# EAGLE design M5 Atom (EAGLE 6.6.0)
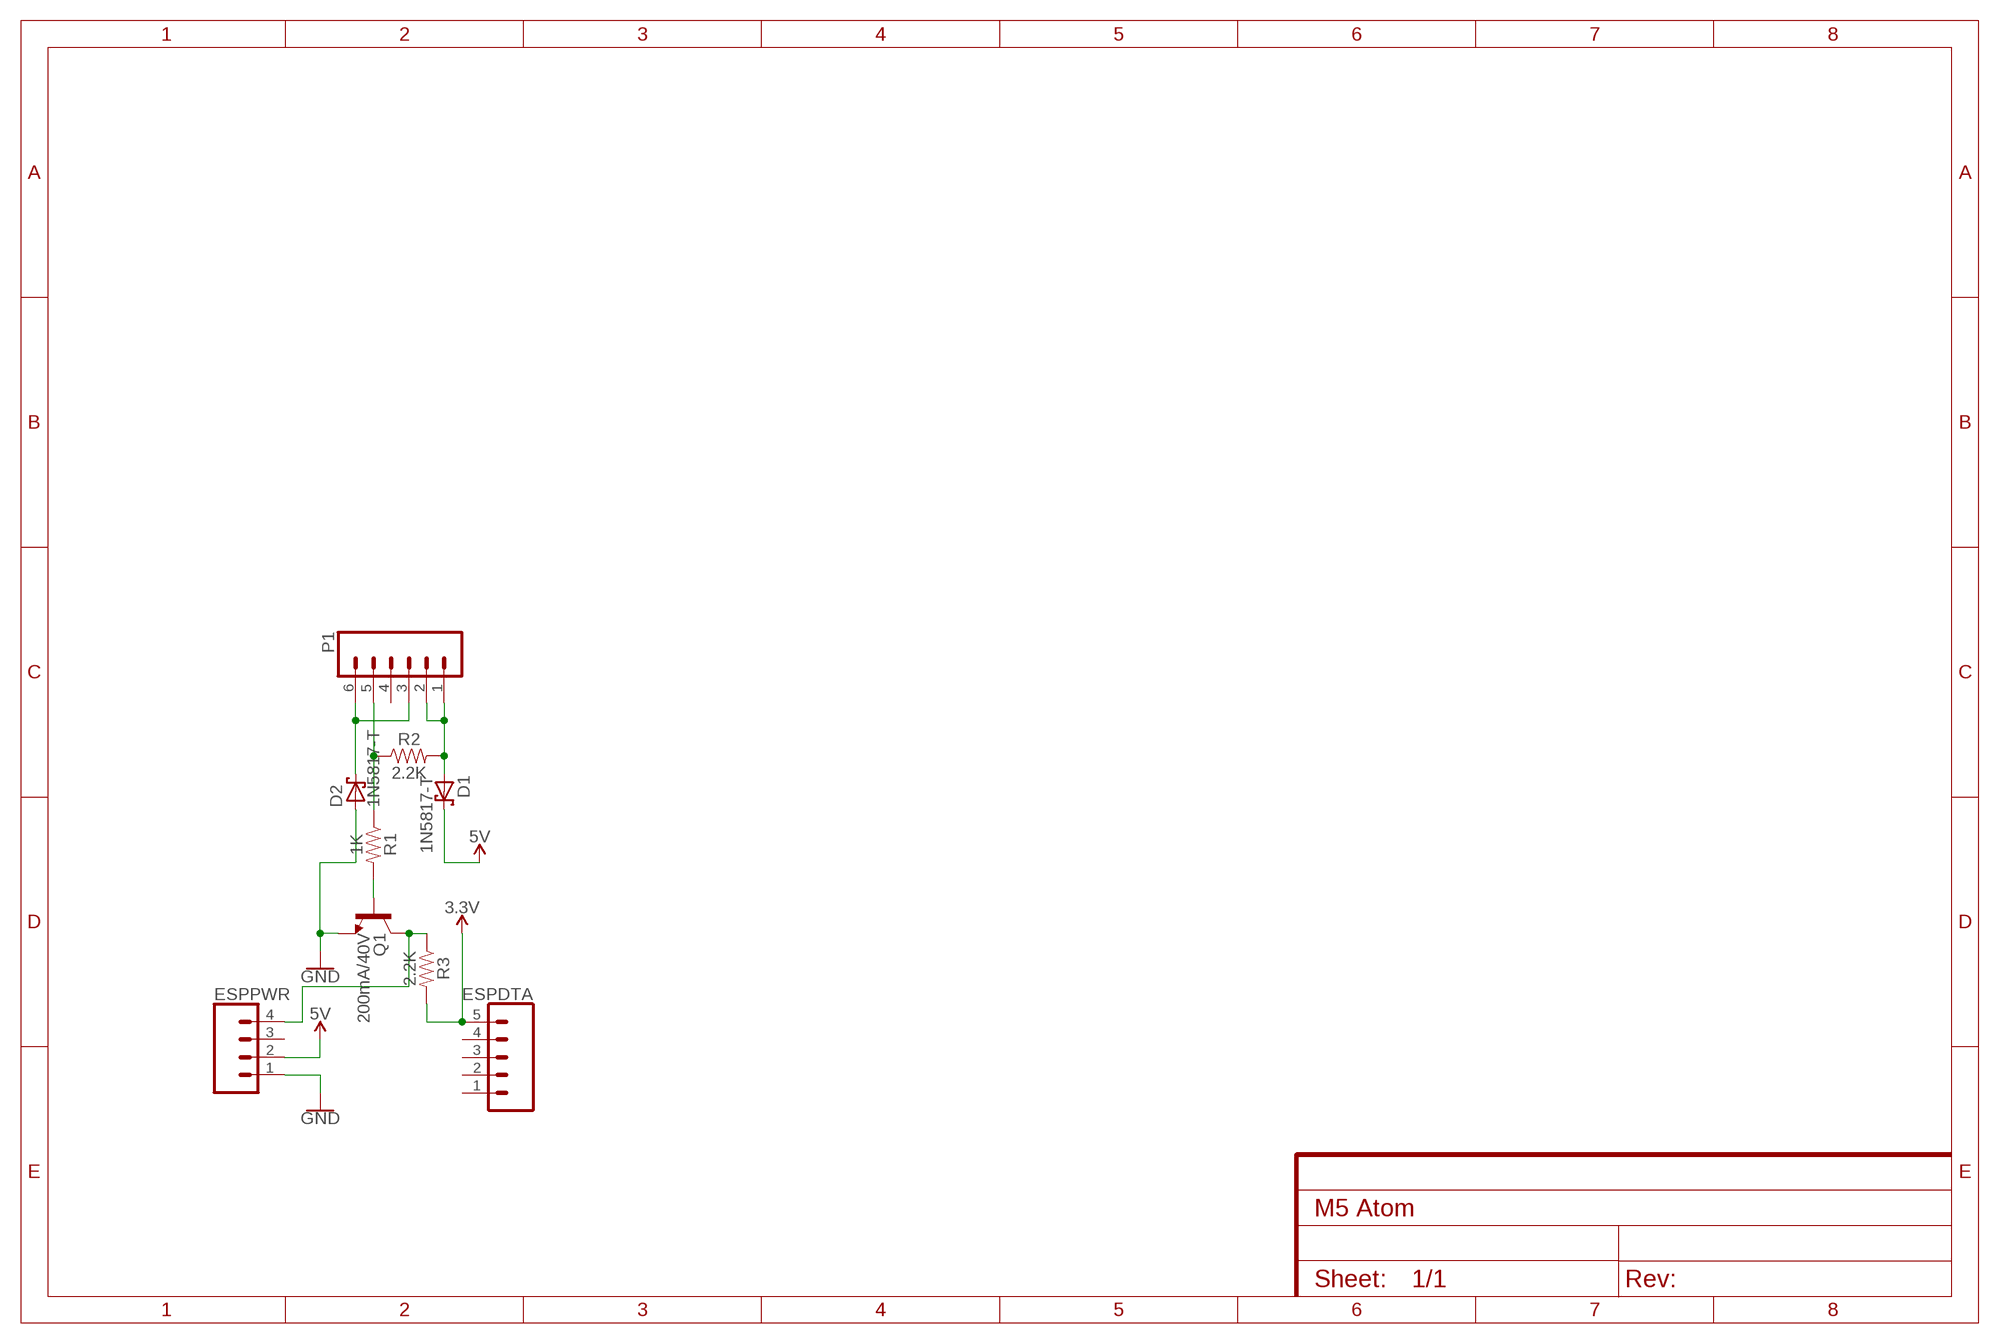
[diagram p0: schematic, sheet 1]

## Parts
D1  1N5817-T  [DO41-7.6]
D2  1N5817-T  [DO41-7.6]
ESPDTA  CONN_05  [1X05]
ESPPWR  CONN_04PTH  [1X04]
P1  CONN_06SILK_FEMALE_PTH  [1X06]
Q1  200mA/40V  TRANS_NPN-2N3904  [TO-92]
R1  1K  RESISTORAXIAL-0.3  [AXIAL-0.3]
R2  2.2K  RESISTORAXIAL-0.3  [AXIAL-0.3]
R3  2.2K  RESISTORAXIAL-0.3  [AXIAL-0.3]

## Nets
3.3V: ESPDTA.5 R3.P$2
5V: D1.C ESPPWR.2
5VH: D1.A P1.1 P1.2 R2.P$2
GND: D2.A ESPPWR.1 Q1.1(E)
GNDH: D2.C P1.3 P1.6
N$2: Q1.2(B) R1.P$2
TXH: P1.5 R1.P$1 R2.P$1
TXL: ESPPWR.4 Q1.3(C) R3.P$1
Unconnected: ESPDTA.1 ESPDTA.2 ESPDTA.3 ESPDTA.4 ESPPWR.3 P1.4

## Library data of the parts
D1 D2 = diode:1N581*: 1.0A SCHOTTKY BARRIER RECTIFIER Source: http://www.diodes.com/datasheets/ds23001.pdf
ESPDTA = SparkFun-Connectors:CONN_05: Multi connection point. Often used as Generic Header-pin footprint for 0.1 inch spaced/style header connections On any of the 0.1 inch spaced packages, you can populate with these: Break Away Headers - Straight <https://www.sparkfun.com/products/116> (PRT-00116) Break Away Male Headers - Right Angle <https://www.sparkfun.com/products/553> (PRT-00553) Female Headers <https://www.sparkfun.com/products/115> (PRT-00115) Break Away Headers - Machine Pin <https://www.sparkfun.com/products/117> (PRT-00117) Break Away Female Headers - Swiss Machine Pin <https://www.sparkfun.com/products/743> (PRT-00743) For SCREWTERMINALS and SPRING TERMINALS visit here: Screw Terimnals on SparkFun.com <https://www.sparkfun.com/search/results?term=Screw+Terminals> (5mm/3.5mm/2.54mm spacing) This device is also useful as a general connection point to wire up your design to another part of your project. Our various solder wires solder well into these plated through hole pads. Hook-Up Wire - Assortment (Stranded, 22 AWG) <https://www.sparkfun.com/products/11375> (PRT-11375) Hook-Up Wire - Assortment (Solid Core, 22 AWG) <https://www.sparkfun.com/products/11367> (PRT-11367) View the entire wire category on our website here <https://www.sparkfun.com/categories/141> Special notes: Molex polarized connector foot print use with SKU : PRT-08231 with associated crimp pins and housings. 1MM SMD Version SKU: PRT-10208
ESPPWR = SparkFun-Connectors:CONN_04: Multi connection point. Often used as Generic Header-pin footprint for 0.1 inch spaced/style header connections On any of the 0.1 inch spaced packages, you can populate with these: Break Away Headers - Straight <https://www.sparkfun.com/products/116> (PRT-00116) Break Away Male Headers - Right Angle <https://www.sparkfun.com/products/553> (PRT-00553) Female Headers <https://www.sparkfun.com/products/115> (PRT-00115) Break Away Headers - Machine Pin <https://www.sparkfun.com/products/117> (PRT-00117) Break Away Female Headers - Swiss Machine Pin <https://www.sparkfun.com/products/743> (PRT-00743) For SCREWTERMINALS and SPRING TERMINALS visit here: Screw Terimnals on SparkFun.com <https://www.sparkfun.com/search/results?term=Screw+Terminals> (5mm/3.5mm/2.54mm spacing) This device is also useful as a general connection point to wire up your design to another part of your project. Our various solder wires solder well into these plated through hole pads. Hook-Up Wire - Assortment (Stranded, 22 AWG) <https://www.sparkfun.com/products/11375> (PRT-11375) Hook-Up Wire - Assortment (Solid Core, 22 AWG) <https://www.sparkfun.com/products/11367> (PRT-11367) View the entire wire category on our website here <https://www.sparkfun.com/categories/141> Special notes: Molex polarized connector foot print use with SKU : PRT-08231 with associated crimp pins and housings. 1MM SMD Version SKU: PRT-10208; PROD_ID: CONN-09696
P1 = SparkFun-Connectors:CONN_06: Multi connection point. Often used as Generic Header-pin footprint for 0.1 inch spaced/style header connections On any of the 0.1 inch spaced packages, you can populate with these: Break Away Headers - Straight <https://www.sparkfun.com/products/116> (PRT-00116) Break Away Male Headers - Right Angle <https://www.sparkfun.com/products/553> (PRT-00553) Female Headers <https://www.sparkfun.com/products/115> (PRT-00115) Break Away Headers - Machine Pin <https://www.sparkfun.com/products/117> (PRT-00117) Break Away Female Headers - Swiss Machine Pin <https://www.sparkfun.com/products/743> (PRT-00743) Arduino Stackable Header - 6 Pin <https://www.sparkfun.com/products/9280> (PRT-09280) For SCREWTERMINALS and SPRING TERMINALS visit here: Screw Terimnals on SparkFun.com <https://www.sparkfun.com/search/results?term=Screw+Terminals> (5mm/3.5mm/2.54mm spacing) This device is also useful as a general connection point to wire up your design to another part of your project. Our various solder wires solder well into these plated through hole pads. Hook-Up Wire - Assortment (Stranded, 22 AWG) <https://www.sparkfun.com/products/11375> (PRT-11375) Hook-Up Wire - Assortment (Solid Core, 22 AWG) <https://www.sparkfun.com/products/11367> (PRT-11367) View the entire wire category on our website here <https://www.sparkfun.com/categories/141>; PROD_ID: CONN-08437
Q1 = SparkFun-DiscreteSemi:TRANS_NPN: NPN transistor Current controlled devices typically used to amplify current or used as a switch. BC547 - COM-08928 <http://www.sparkfun.com/products/8928> (TO-92 45V 100mA) (1.Collector 2.Base 3.Emitter) 2N3904 - COM-00521 <http://www.sparkfun.com/products/521> (TO-92 40V 200mA) (1.Emitter 2.Base 3.Collector) P2N2222A - COM-12852 <http://www.sparkfun.com/products/12852> (TO-92 40V 600mA) (1.Collector 2.Base 3.Emitter); PROD_ID: TRANS-08447
R1-R3 = SparkFun-Resistors:RESISTOR: Generic Resistor Package

## Board
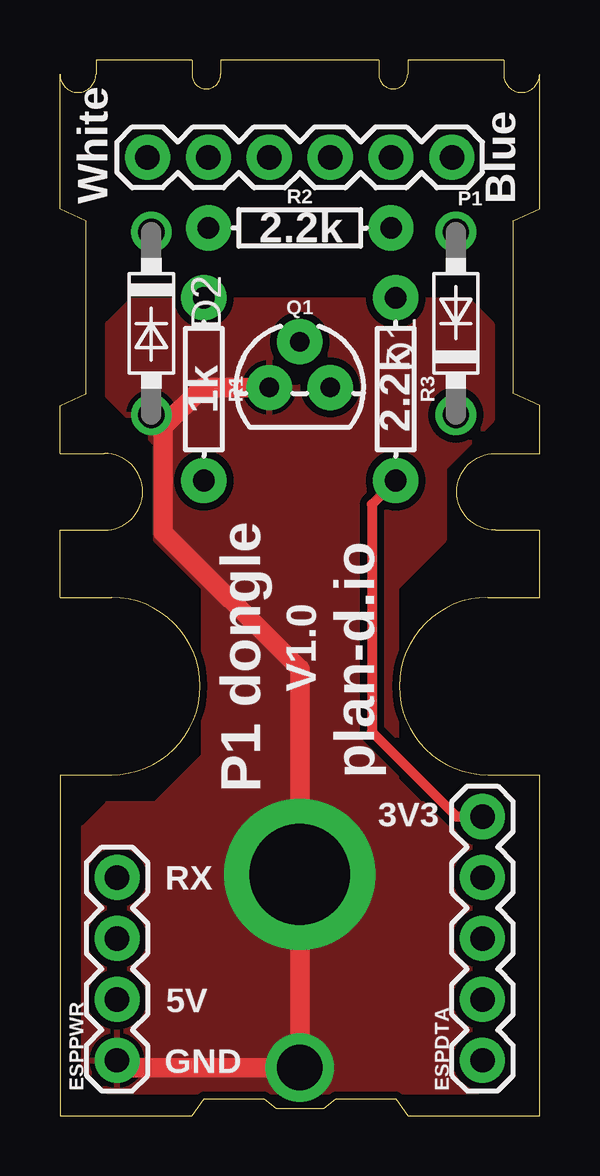
[diagram p1: board, top side]
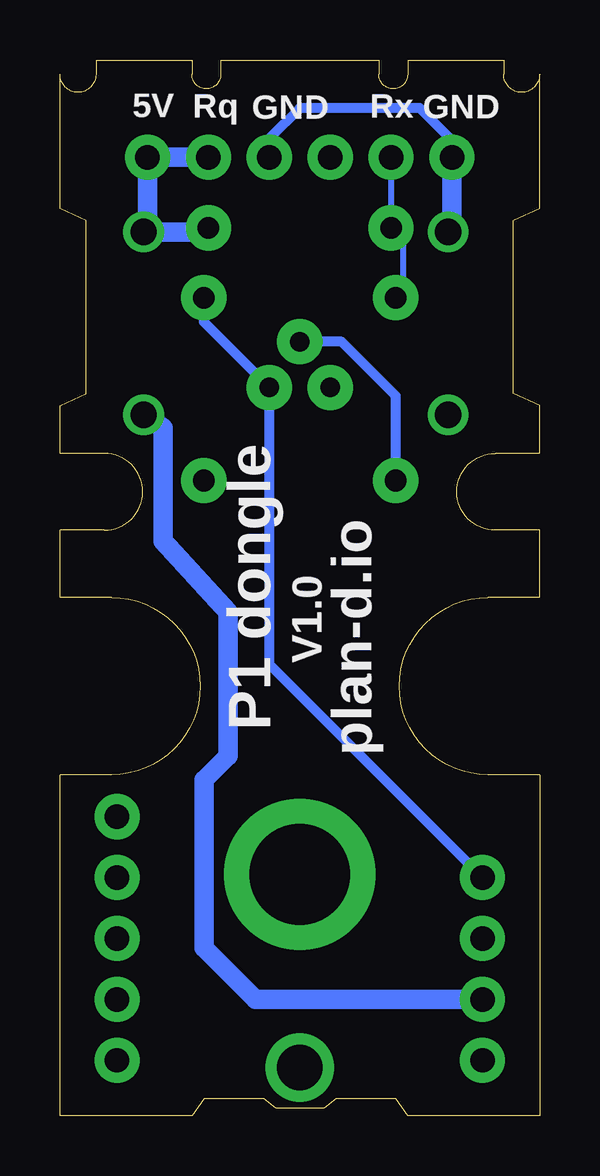
[diagram p2: board, bottom side, seen from below]

Size 20 x 44 mm. Coordinates in mm from the lower left corner, seen from the top.
Outline: 0,0 5.5,0 6,0.7 8.5,0.7 9,0.3 11,0.3 11.5,0.7 14,0.7 14.5,0 20,0 20,14.2 17.85,14.2 arc-180 17.85,21.6 20,21.6 20,24.4 18.15,24.4 arc-180 18.15,27.6 20,27.6 20,29.6 18.9,30.1 18.9,37.3 20,37.8 20,43.4 arc-180 18.5,43.4 18.5,44 14.5,44 14.5,43.4 arc-180 13.3,43.4 13.3,44 6.7,44 6.7,43.4 arc-180 5.5,43.4 5.5,44 1.5,44 1.5,43.4 arc-180 0,43.4 0,37.8 1.1,37.3 1.1,30.1 0,29.6 0,27.6 1.85,27.6 arc-180 1.85,24.4 0,24.4 0,21.6 2.15,21.6 arc-180 2.15,14.2 0,14.2 0,0
Copper layers (1*16): Top 0.018mm / dielectric 1.55mm / Bottom 0.018mm
Design rules "eC_2Layer_PClass6_BaseCopperO18_eCDefault": minimum track width 0.15mm, minimum drill 0.35mm, track to track 0.15mm, track to pad 0.15mm, pad to pad 0.15mm, via to via 0.15mm, smd to smd 0mil, copper to edge 0.25mm, drill to drill 0.35mm, minimum pad ring 0.175mm, minimum via ring 0.125mm, stop-mask expansion 0mil, vias tented up to drill 0.45mm, thermal gap 0.2mm

### Footprints (pad centres in the part's own frame; a part is rotated, then mirrored left to right if it is on the bottom)
DO41-7.6 = drill 1.1 pad 1.7: A 3.81,0; C -3.81,0
1X05 = drill 1.016 pad 1.88: 1 0,0; 2 2.54,0; 3 5.08,0; 4 7.62,0; 5 10.16,0
1X04 = drill 1.016 pad 1.88: 1 0,0; 2 2.54,0; 3 5.08,0; 4 7.62,0
1X06 = drill 1.016 pad 1.88: 1 0,0; 2 2.54,0; 3 5.08,0; 4 7.62,0; 5 10.16,0; 6 12.7,0
TO-92 = drill 0.813 pad 1.88: 1 -1.27,0; 2 0,1.905; 3 1.27,0
AXIAL-0.3 = drill 0.9 pad 1.88: P$1 -3.81,0; P$2 3.81,0

### Placement (x,y rotation side)
D1  16.51,33.02 90 top
D2  3.81,33.02 270 top
ESPDTA  17.62,2.3 90 top
ESPPWR  2.38,2.3 90 top
P1  16.35,39.94 180 top
Q1  10,30.35 0 top
R1  6,30.28 270 top
R2  10,37 0 top
R3  14,30.28 270 top

### Tracks (layer width: path | path; a pad name or v marks a point on that pad's centre or on a via)
3.3V
  Top 0.406: R3.P$2 13,25.47 13,16 16.54,12.46 ESPDTA.5
5V
  Bottom 0.813: D1.C 15.7,28.65 15.7,23.95 13,21 13,15 14,14 14,7 11.84,4.84 ESPPWR.2
5VH
  Bottom 0.813: R2.P$2 13.98,36.83 D1.A 16.35,36.99 P1.1 P1.2
GND  (via drill 1.9, 4.2)
  Top 0.813: D2.A 4.31,28.71 | 4.31,28.71 4.31,24.3 10,18.61 v10,2 2.68,2 ESPPWR.1 | 4.31,28.71 5.95,30.35 Q1.1
  other vias: 10,10.05
  pour Top (isolate 0.305): 1,2 1,12 2,13 4,13 6,15 6,22 4,24 4,27 4,28 2,30 2,33 3,34 17,34 18,33 18,30 18,29 17,28 16,27 16,24 14,22 14,15 14,14 15,13 18,13 19,12 19,2 18,1 2,1
GNDH
  Bottom 0.406: P1.6 3.65,40.65 5,42 10,42 11.27,40.73 P1.3
  Bottom 0.813: P1.6 3.65,36.99 D2.C
N$2
  Bottom 0.406: R1.P$2 6,30 8.26,32.26 Q1.2
TXH
  Bottom 0.254: P1.5 R2.P$1 5.7,36.51 5.7,34.59 R1.P$1
TXL
  Bottom 0.406: ESPPWR.4 11.27,18.81 Q1.3 14,33.08 R3.P$1

### Text on the board
tPlace: White | Blue | 2.2k | 1k | 2.2k | V1.0 | plan-d.io | P1 dongle | 3V3 | RX | 5V | GND
bPlace: GND | Rx | GND | Rq | 5V | P1 dongle | V1.0 | plan-d.io